# EAGLE schematic isolator (EAGLE 5.06)

## Sheet 1 of 5
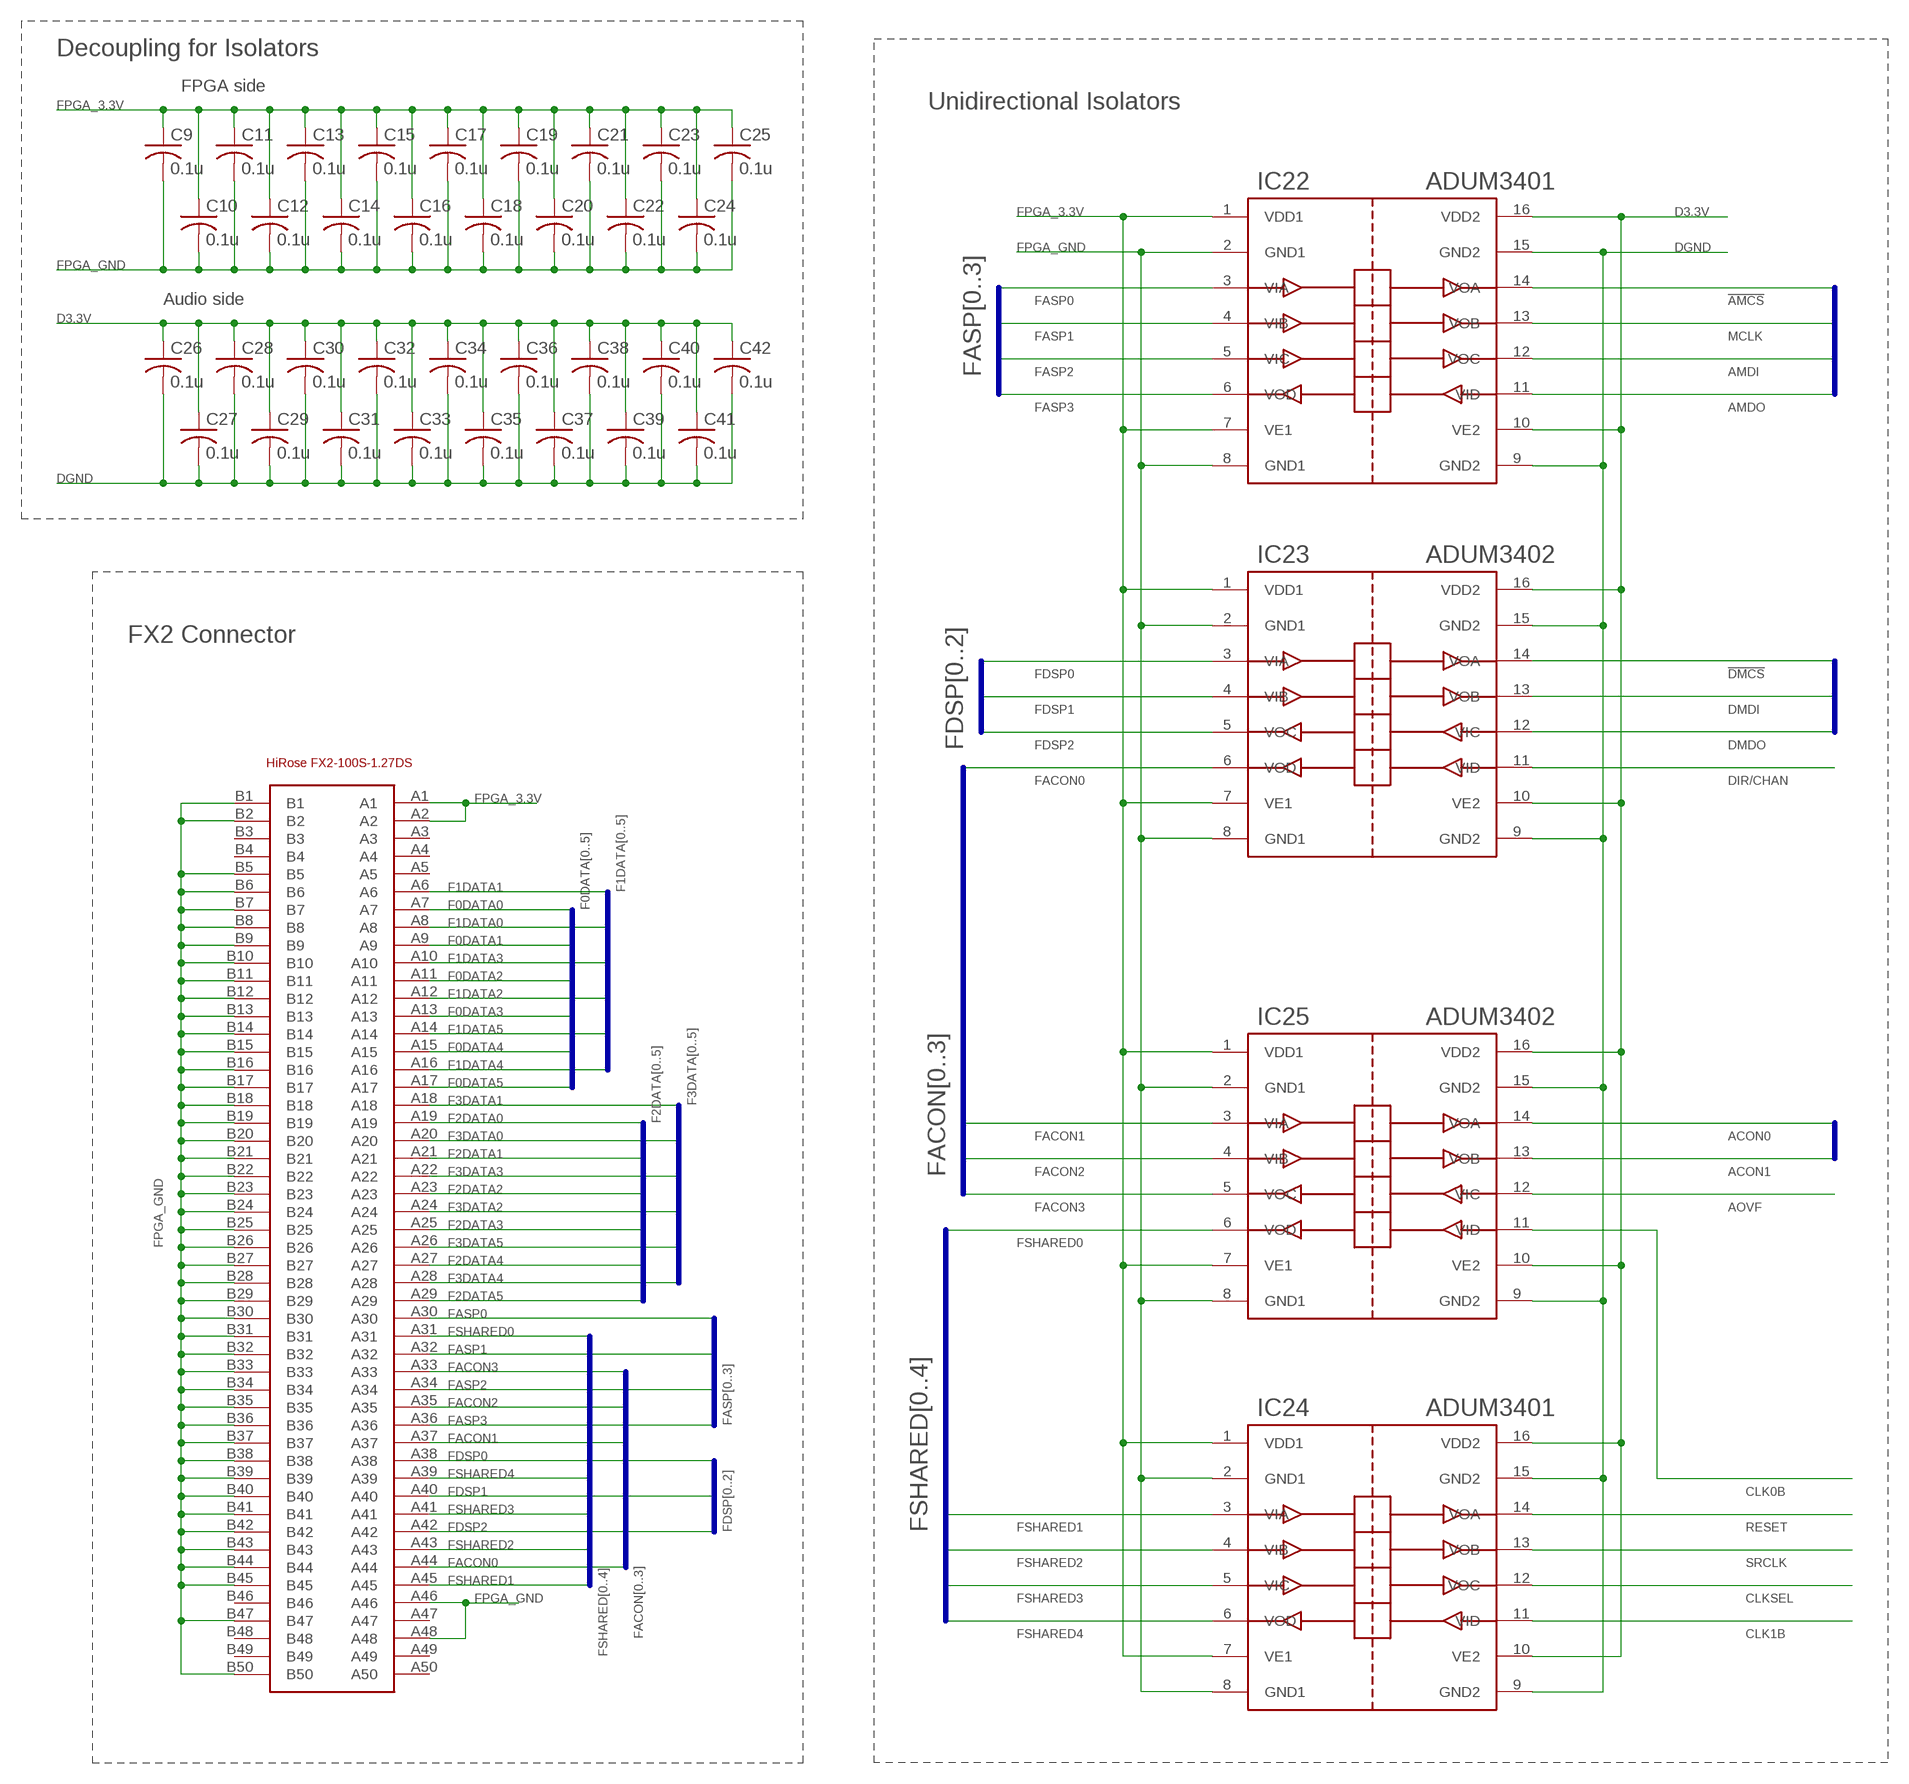
[diagram p0: schematic, sheet 1]

### Parts
C9  0.1u  C-USC1206  [C1206]
C10  0.1u  C-USC1206  [C1206]
C11  0.1u  C-USC1206  [C1206]
C12  0.1u  C-USC1206  [C1206]
C13  0.1u  C-USC1206  [C1206]
C14  0.1u  C-USC1206  [C1206]
C15  0.1u  C-USC1206  [C1206]
C16  0.1u  C-USC1206  [C1206]
C17  0.1u  C-USC1206  [C1206]
C18  0.1u  C-USC1206  [C1206]
C19  0.1u  C-USC1206  [C1206]
C20  0.1u  C-USC1206  [C1206]
C21  0.1u  C-USC1206  [C1206]
C22  0.1u  C-USC1206  [C1206]
C23  0.1u  C-USC1206  [C1206]
C24  0.1u  C-USC1206  [C1206]
C25  0.1u  C-USC1206  [C1206]
C26  0.1u  C-USC1206  [C1206]
C27  0.1u  C-USC1206  [C1206]
C28  0.1u  C-USC1206  [C1206]
C29  0.1u  C-USC1206  [C1206]
C30  0.1u  C-USC1206  [C1206]
C31  0.1u  C-USC1206  [C1206]
C32  0.1u  C-USC1206  [C1206]
C33  0.1u  C-USC1206  [C1206]
C34  0.1u  C-USC1206  [C1206]
C35  0.1u  C-USC1206  [C1206]
C36  0.1u  C-USC1206  [C1206]
C37  0.1u  C-USC1206  [C1206]
C38  0.1u  C-USC1206  [C1206]
C39  0.1u  C-USC1206  [C1206]
C40  0.1u  C-USC1206  [C1206]
C41  0.1u  C-USC1206  [C1206]
C42  0.1u  C-USC1206  [C1206]
IC22  ADUM3401  [SO-16W]
IC23  ADUM3402  [SO-16W]
IC24  ADUM3401  [SO-16W]
IC25  ADUM3402  [SO-16W]
J1  HIROSE-FX2-100S-1.27DS  [HIROSE-FX2-100]

### Nets
!AMCS: IC22.14(VOA) ; also sheet 5
!DMCS: IC23.14(VOA) ; also sheet 5
ACON0: IC25.14(VOA) ; also sheet 4
ACON1: IC25.13(VOB) ; also sheet 4
AMDI: IC22.12(VOC) ; also sheet 4
AMDO: IC22.11(VID) ; also sheet 4
AOVF: IC25.12(VIC) ; also sheet 5
CLK0B: IC25.11(VID) ; also sheet 5
CLK1B: IC24.11(VID) ; also sheet 5
CLKSEL: IC24.12(VOC) ; also sheet 5
D3.3V: C26.1 C27.1 C28.1 C29.1 C30.1 C31.1 C32.1 C33.1 C34.1 C35.1 C36.1 C37.1 C38.1 C39.1 C40.1 C41.1 C42.1 IC22.10(VE2) IC22.16(VDD2) IC23.10(VE2) IC23.16(VDD2) IC24.10(VE2) IC24.16(VDD2) IC25.10(VE2) IC25.16(VDD2) ; also sheet 2,3,4,5
DGND: C26.2 C27.2 C28.2 C29.2 C30.2 C31.2 C32.2 C33.2 C34.2 C35.2 C36.2 C37.2 C38.2 C39.2 C40.2 C41.2 C42.2 IC22.9(GND2) IC22.15(GND2) IC23.9(GND2) IC23.15(GND2) IC24.9(GND2) IC24.15(GND2) IC25.9(GND2) IC25.15(GND2) ; also sheet 2,3,4,5
DIR/CHAN: IC23.11(VID) ; also sheet 5
DMDI: IC23.13(VOB) ; also sheet 4
DMDO: IC23.12(VIC) ; also sheet 4
F0DATA0: J1.A7 ; also sheet 2
F0DATA1: J1.A9 ; also sheet 2
F0DATA2: J1.A11 ; also sheet 2
F0DATA3: J1.A13 ; also sheet 2
F0DATA4: J1.A15 ; also sheet 2
F0DATA5: J1.A17 ; also sheet 2
F1DATA0: J1.A8 ; also sheet 2
F1DATA1: J1.A6 ; also sheet 2
F1DATA2: J1.A12 ; also sheet 2
F1DATA3: J1.A10 ; also sheet 2
F1DATA4: J1.A16 ; also sheet 2
F1DATA5: J1.A14 ; also sheet 2
F2DATA0: J1.A19 ; also sheet 2
F2DATA1: J1.A21 ; also sheet 2
F2DATA2: J1.A23 ; also sheet 2
F2DATA3: J1.A25 ; also sheet 2
F2DATA4: J1.A27 ; also sheet 2
F2DATA5: J1.A29 ; also sheet 2
F3DATA0: J1.A20 ; also sheet 2
F3DATA1: J1.A18 ; also sheet 2
F3DATA2: J1.A24 ; also sheet 2
F3DATA3: J1.A22 ; also sheet 2
F3DATA4: J1.A28 ; also sheet 2
F3DATA5: J1.A26 ; also sheet 2
FACON0: IC23.6(VOD) J1.A44
FACON1: IC25.3(VIA) J1.A37
FACON2: IC25.4(VIB) J1.A35
FACON3: IC25.5(VOC) J1.A33
FASP0: IC22.3(VIA) J1.A30
FASP1: IC22.4(VIB) J1.A32
FASP2: IC22.5(VIC) J1.A34
FASP3: IC22.6(VOD) J1.A36
FDSP0: IC23.3(VIA) J1.A38
FDSP1: IC23.4(VIB) J1.A40
FDSP2: IC23.5(VOC) J1.A42
FPGA_3.3V: C9.1 C10.1 C11.1 C12.1 C13.1 C14.1 C15.1 C16.1 C17.1 C18.1 C19.1 C20.1 C21.1 C22.1 C23.1 C24.1 C25.1 IC22.1(VDD1) IC22.7(VE1) IC23.1(VDD1) IC23.7(VE1) IC24.1(VDD1) IC24.7(VE1) IC25.1(VDD1) IC25.7(VE1) J1.A1 J1.A2 ; also sheet 2
FPGA_GND: C9.2 C10.2 C11.2 C12.2 C13.2 C14.2 C15.2 C16.2 C17.2 C18.2 C19.2 C20.2 C21.2 C22.2 C23.2 C24.2 C25.2 IC22.2(GND1) IC22.8(GND1) IC23.2(GND1) IC23.8(GND1) IC24.2(GND1) IC24.8(GND1) IC25.2(GND1) IC25.8(GND1) J1.A46 J1.A48 J1.B1 J1.B2 J1.B5 J1.B6 J1.B7 J1.B8 J1.B9 J1.B10 J1.B11 J1.B12 J1.B13 J1.B14 J1.B15 J1.B16 J1.B17 J1.B18 J1.B19 J1.B20 J1.B21 J1.B22 J1.B23 J1.B24 J1.B25 J1.B26 J1.B27 J1.B28 J1.B29 J1.B30 J1.B31 J1.B32 J1.B33 J1.B34 J1.B35 J1.B36 J1.B37 J1.B38 J1.B39 J1.B40 J1.B41 J1.B42 J1.B43 J1.B44 J1.B45 J1.B47 J1.B50 ; also sheet 2
FSHARED0: IC25.6(VOD) J1.A31
FSHARED1: IC24.3(VIA) J1.A45
FSHARED2: IC24.4(VIB) J1.A43
FSHARED3: IC24.5(VIC) J1.A41
FSHARED4: IC24.6(VOD) J1.A39
MCLK: IC22.13(VOB) ; also sheet 4,5
RESET: IC24.14(VOA) ; also sheet 4
SRCLK: IC24.13(VOB) ; also sheet 4,5
Unconnected: J1.A3 J1.A4 J1.A5 J1.A47 J1.A49 J1.A50 J1.B3 J1.B4 J1.B46 J1.B48 J1.B49

### Buses
F1DATA[0..5]
F2DATA[0..5]
F3DATA[0..5]
F0DATA[0..5]
FASP[0..3]
FSHARED[0..4]
!AMCS,MCLK,AMDI,AMDO
!DMCS,MCLK,DMDI,DMDO
ACON[0..1]
FDSP[0..2]
FACON[0..3]

### Notes on the sheet
- Decoupling for Isolators
- FPGA side
- Unidirectional Isolators
- Audio side
- FX2 Connector

## Sheet 2 of 5
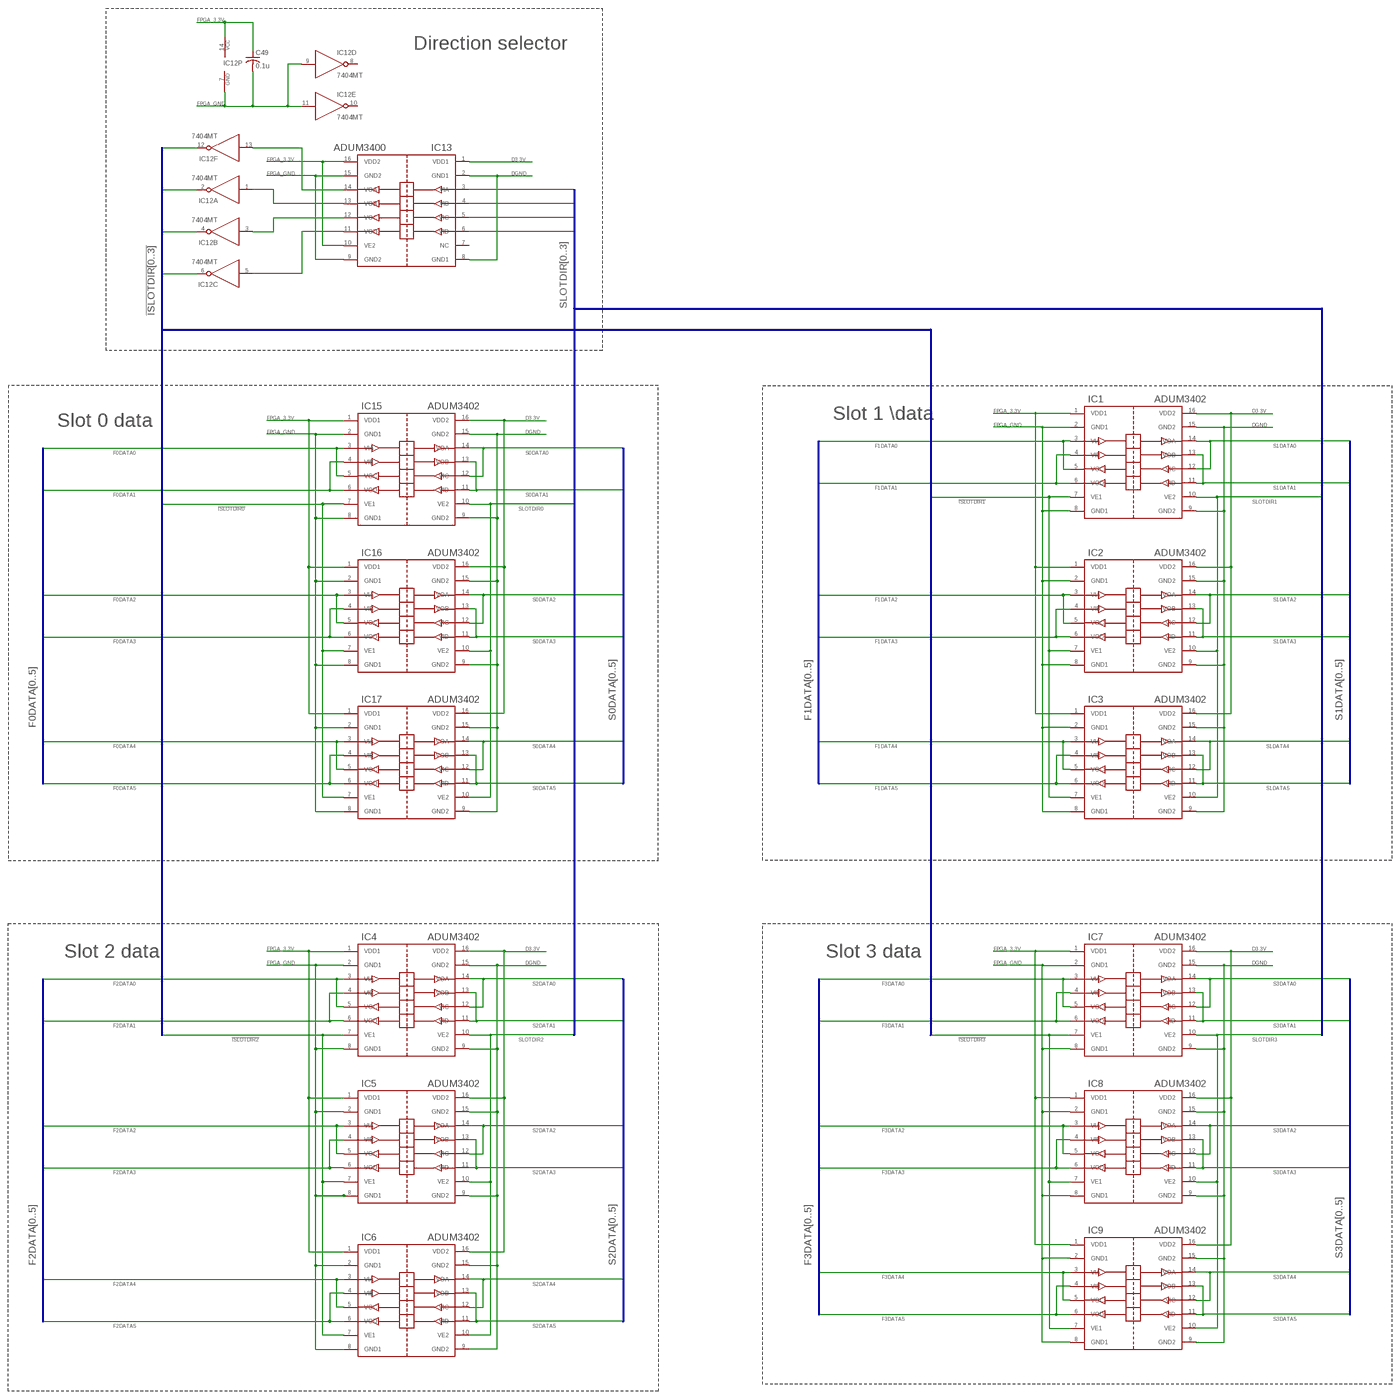
[diagram p1: schematic, sheet 2, overview]
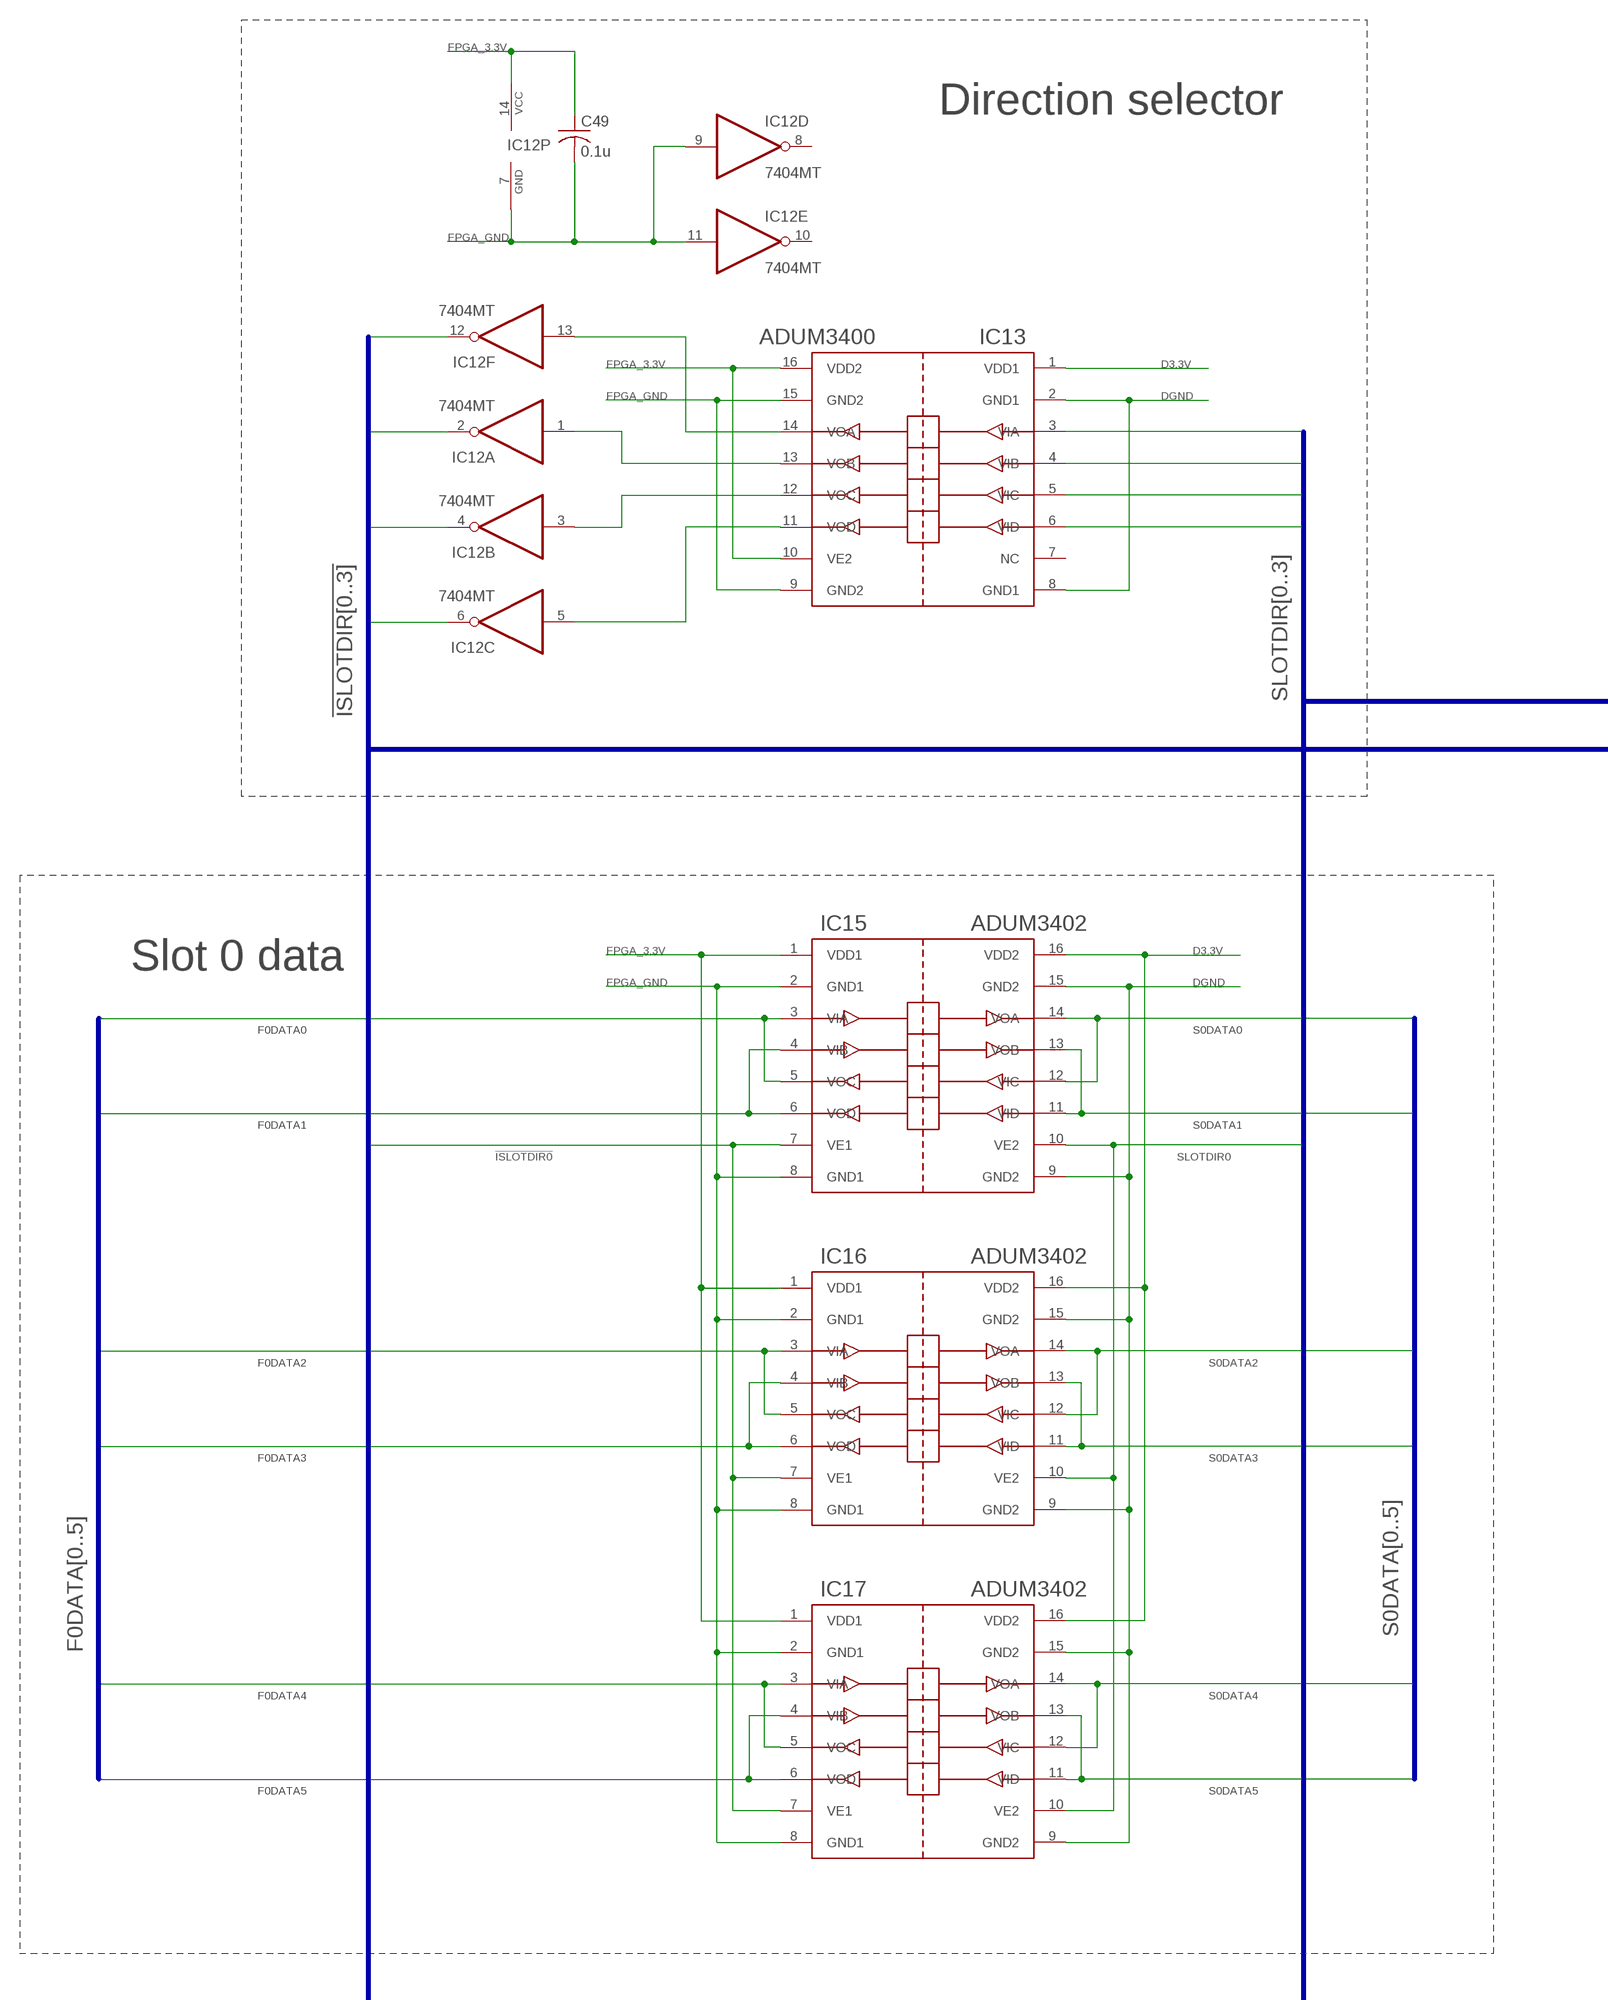
[diagram p2: schematic, sheet 2, part 1 of 4]
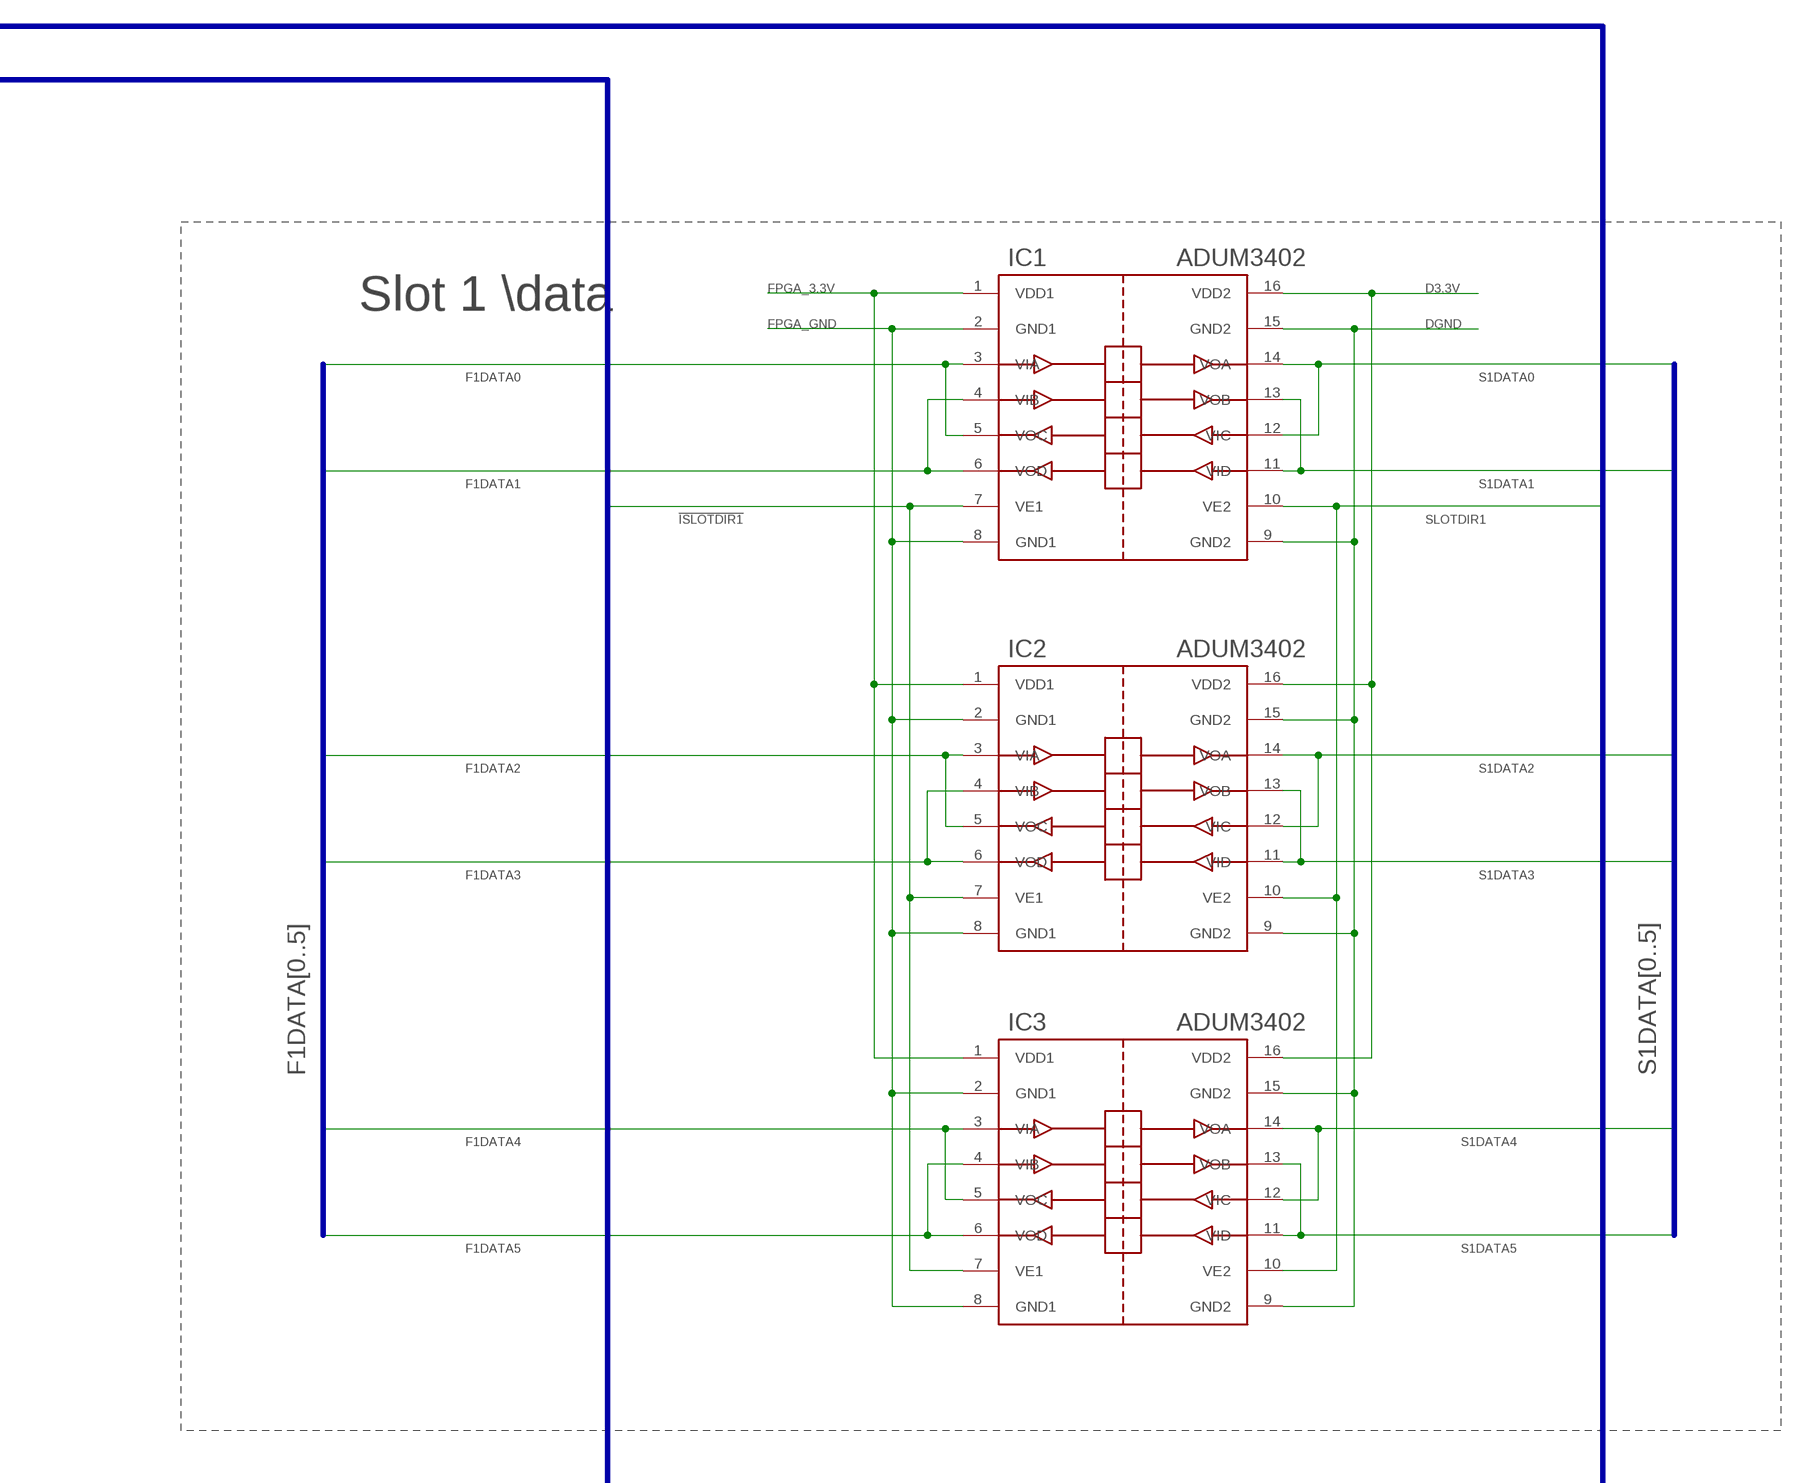
[diagram p3: schematic, sheet 2, part 2 of 4]
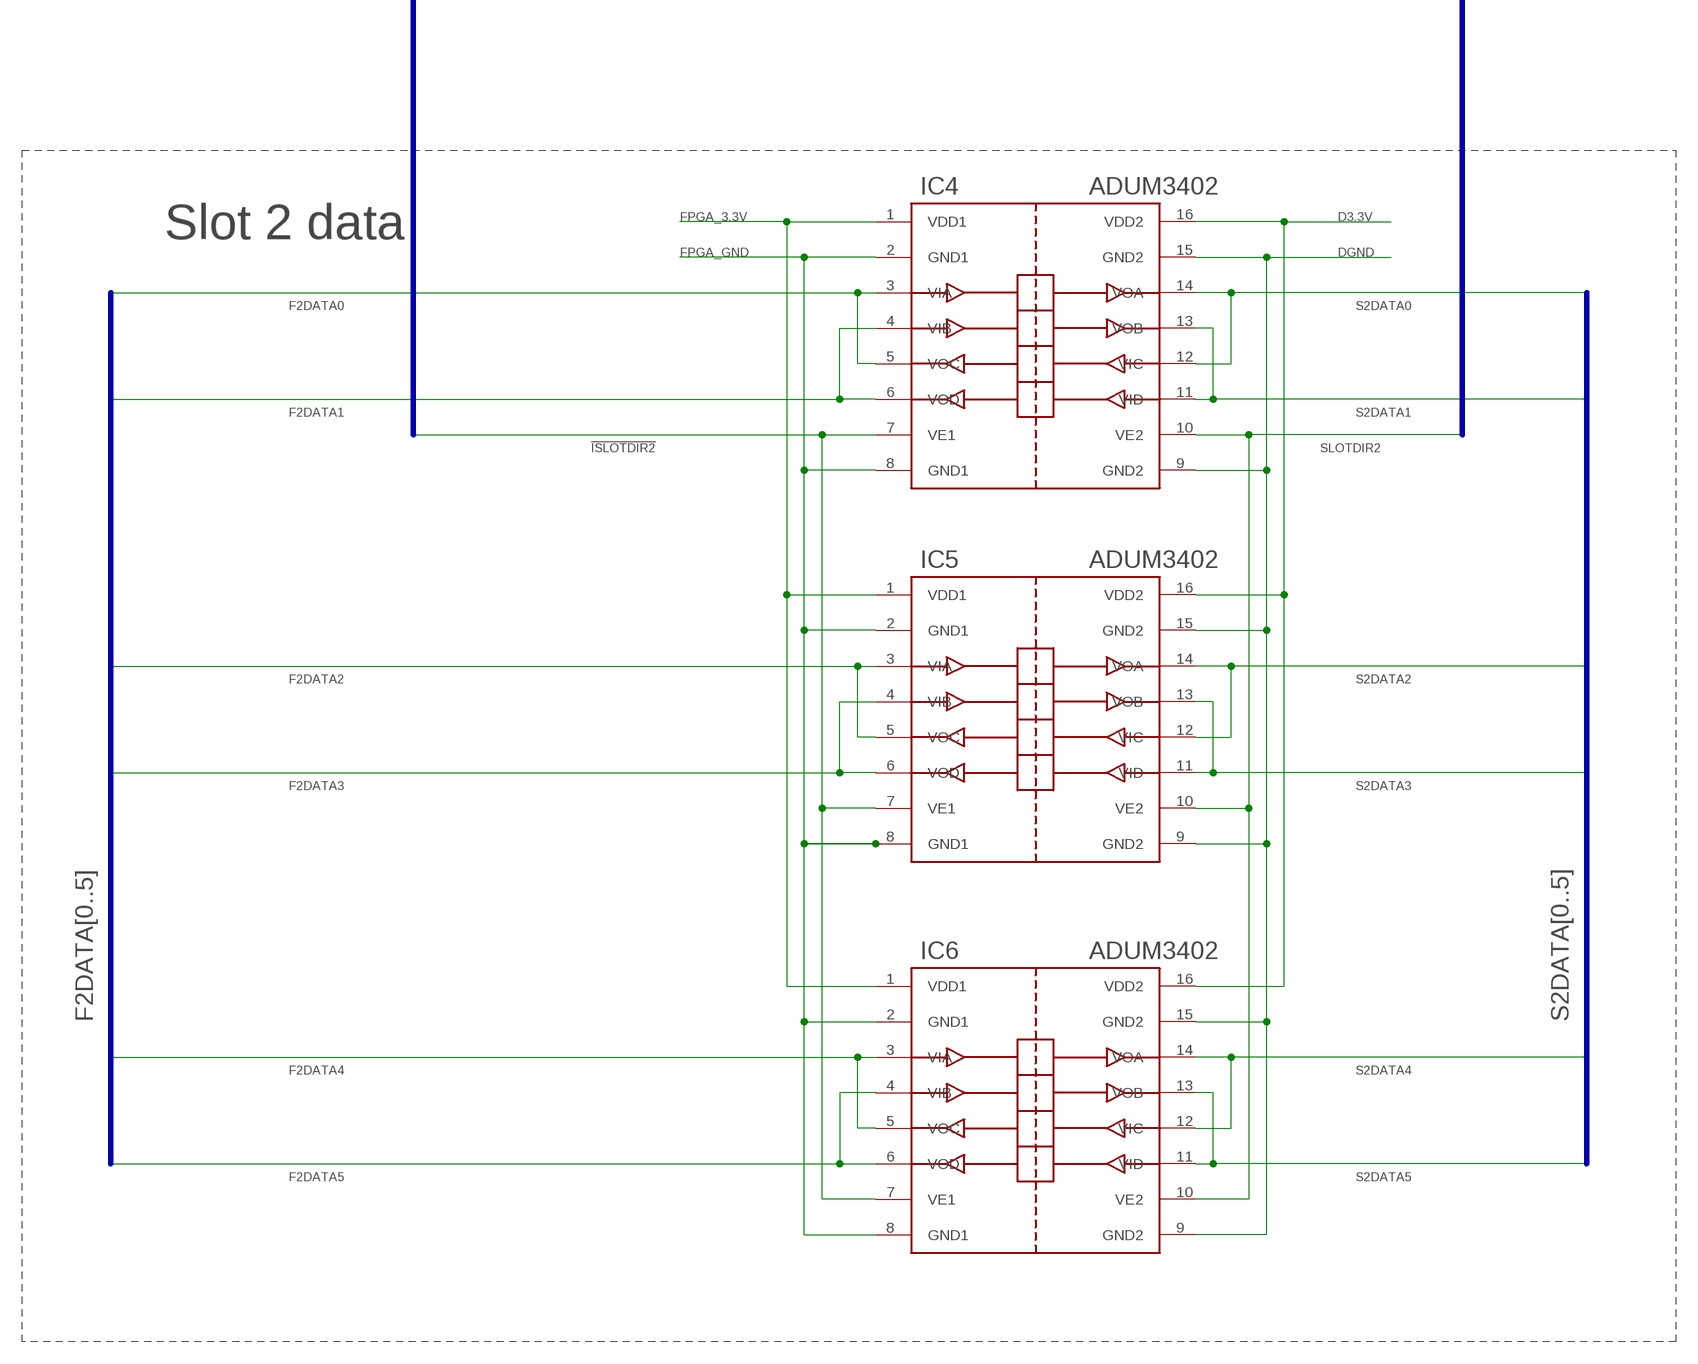
[diagram p4: schematic, sheet 2, part 3 of 4]
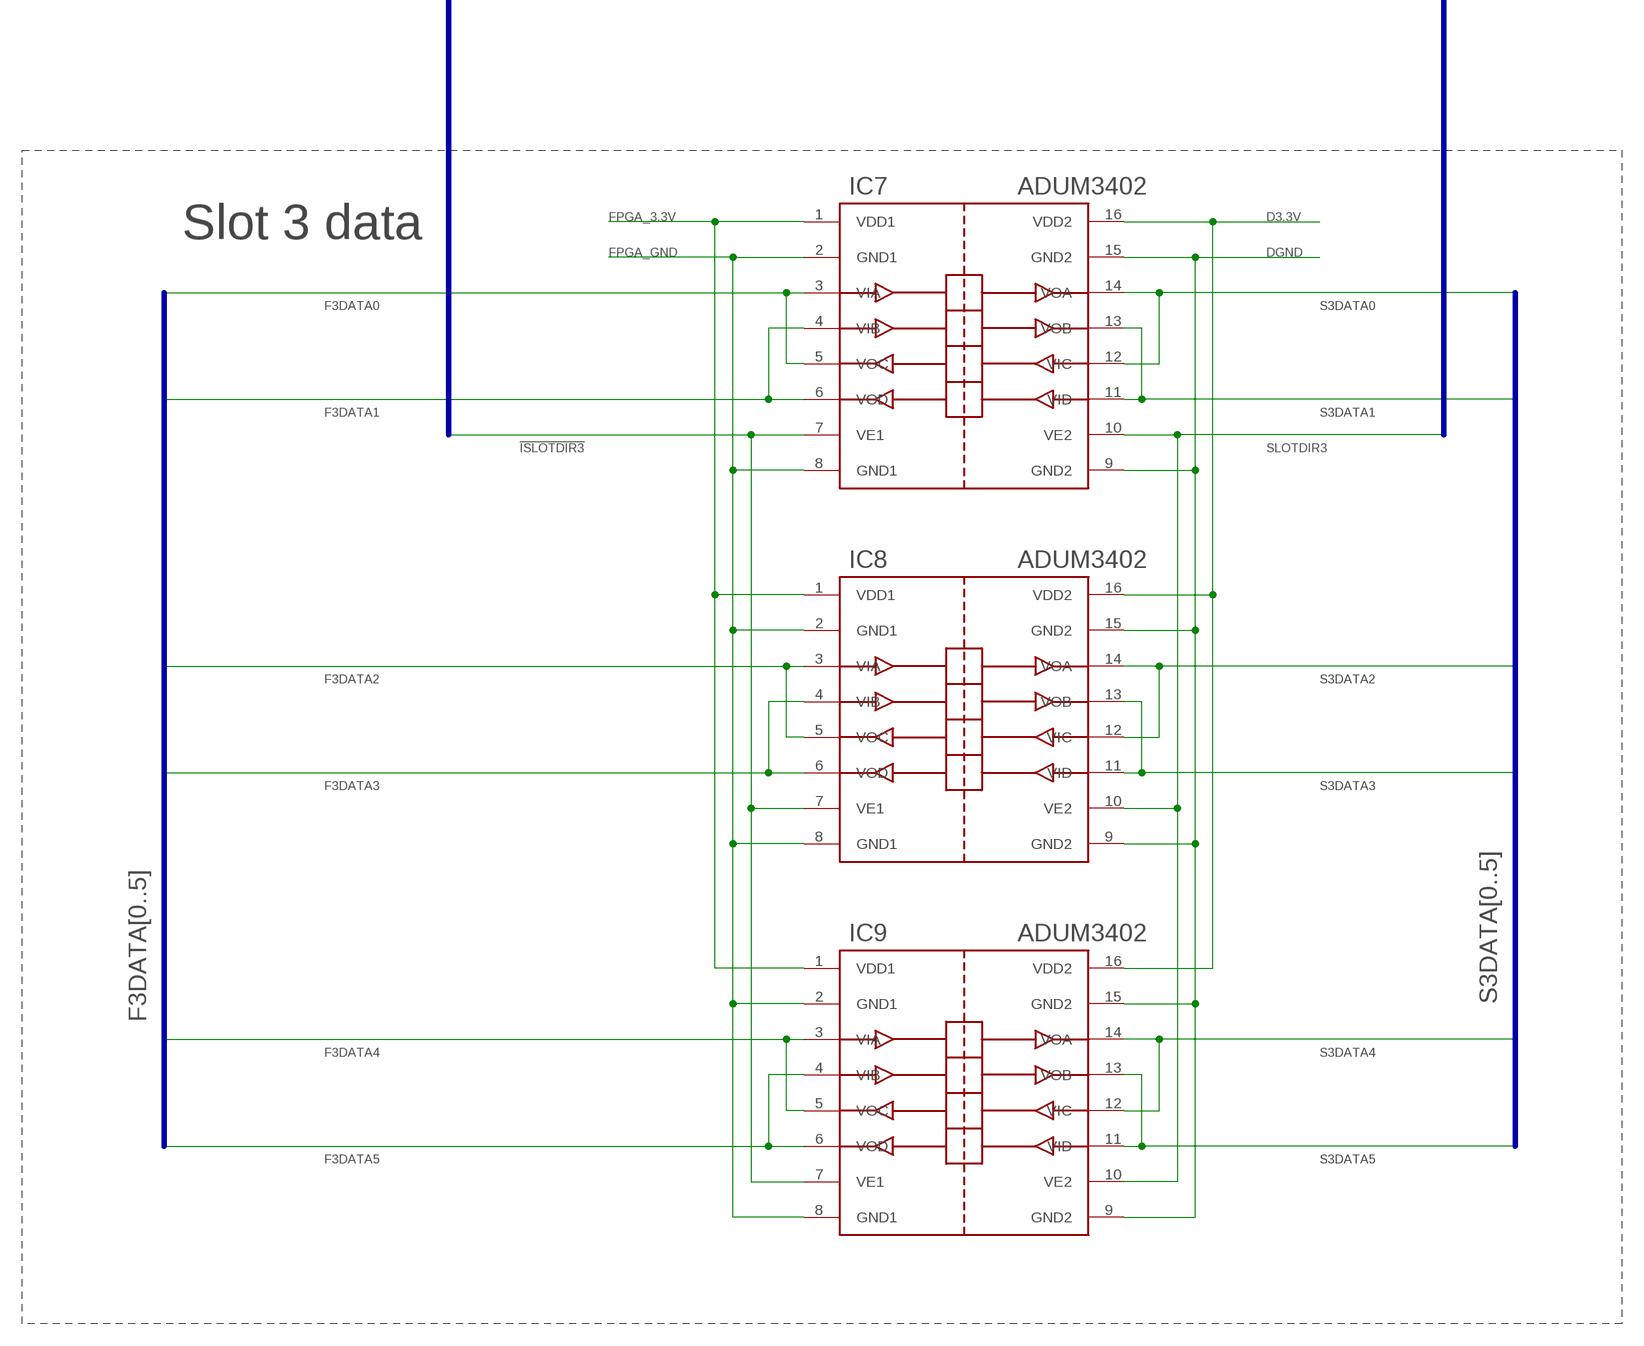
[diagram p5: schematic, sheet 2, part 4 of 4]

### Parts
C49  0.1u  C-USC1206  [C1206]
IC1  ADUM3402  [SO-16W]
IC2  ADUM3402  [SO-16W]
IC3  ADUM3402  [SO-16W]
IC4  ADUM3402  [SO-16W]
IC5  ADUM3402  [SO-16W]
IC6  ADUM3402  [SO-16W]
IC7  ADUM3402  [SO-16W]
IC8  ADUM3402  [SO-16W]
IC9  ADUM3402  [SO-16W]
IC12  7404MT  [TSSOP14]
IC13  ADUM3400  [SO-16W]
IC15  ADUM3402  [SO-16W]
IC16  ADUM3402  [SO-16W]
IC17  ADUM3402  [SO-16W]

### Nets
!ISLOTDIR0: IC12.6(C:O) IC15.7(VE1) IC16.7(VE1) IC17.7(VE1)
!ISLOTDIR1: IC1.7(VE1) IC2.7(VE1) IC3.7(VE1) IC12.4(B:O)
!ISLOTDIR2: IC4.7(VE1) IC5.7(VE1) IC6.7(VE1) IC12.2(A:O)
!ISLOTDIR3: IC7.7(VE1) IC8.7(VE1) IC9.7(VE1) IC12.12(F:O)
D3.3V: IC1.16(VDD2) IC2.16(VDD2) IC3.16(VDD2) IC4.16(VDD2) IC5.16(VDD2) IC6.16(VDD2) IC7.16(VDD2) IC8.16(VDD2) IC9.16(VDD2) IC13.1(VDD1) IC15.16(VDD2) IC16.16(VDD2) IC17.16(VDD2) ; also sheet 1,3,4,5
DGND: IC1.9(GND2) IC1.15(GND2) IC2.9(GND2) IC2.15(GND2) IC3.9(GND2) IC3.15(GND2) IC4.9(GND2) IC4.15(GND2) IC5.9(GND2) IC5.15(GND2) IC6.9(GND2) IC6.15(GND2) IC7.9(GND2) IC7.15(GND2) IC8.9(GND2) IC8.15(GND2) IC9.9(GND2) IC9.15(GND2) IC13.2(GND1) IC13.8(GND1) IC15.9(GND2) IC15.15(GND2) IC16.9(GND2) IC16.15(GND2) IC17.9(GND2) IC17.15(GND2) ; also sheet 1,3,4,5
F0DATA0: IC15.3(VIA) IC15.5(VOC) ; also sheet 1
F0DATA1: IC15.4(VIB) IC15.6(VOD) ; also sheet 1
F0DATA2: IC16.3(VIA) IC16.5(VOC) ; also sheet 1
F0DATA3: IC16.4(VIB) IC16.6(VOD) ; also sheet 1
F0DATA4: IC17.3(VIA) IC17.5(VOC) ; also sheet 1
F0DATA5: IC17.4(VIB) IC17.6(VOD) ; also sheet 1
F1DATA0: IC1.3(VIA) IC1.5(VOC) ; also sheet 1
F1DATA1: IC1.4(VIB) IC1.6(VOD) ; also sheet 1
F1DATA2: IC2.3(VIA) IC2.5(VOC) ; also sheet 1
F1DATA3: IC2.4(VIB) IC2.6(VOD) ; also sheet 1
F1DATA4: IC3.3(VIA) IC3.5(VOC) ; also sheet 1
F1DATA5: IC3.4(VIB) IC3.6(VOD) ; also sheet 1
F2DATA0: IC4.3(VIA) IC4.5(VOC) ; also sheet 1
F2DATA1: IC4.4(VIB) IC4.6(VOD) ; also sheet 1
F2DATA2: IC5.3(VIA) IC5.5(VOC) ; also sheet 1
F2DATA3: IC5.4(VIB) IC5.6(VOD) ; also sheet 1
F2DATA4: IC6.3(VIA) IC6.5(VOC) ; also sheet 1
F2DATA5: IC6.4(VIB) IC6.6(VOD) ; also sheet 1
F3DATA0: IC7.3(VIA) IC7.5(VOC) ; also sheet 1
F3DATA1: IC7.4(VIB) IC7.6(VOD) ; also sheet 1
F3DATA2: IC8.3(VIA) IC8.5(VOC) ; also sheet 1
F3DATA3: IC8.4(VIB) IC8.6(VOD) ; also sheet 1
F3DATA4: IC9.3(VIA) IC9.5(VOC) ; also sheet 1
F3DATA5: IC9.4(VIB) IC9.6(VOD) ; also sheet 1
FPGA_3.3V: C49.1 IC1.1(VDD1) IC2.1(VDD1) IC3.1(VDD1) IC4.1(VDD1) IC5.1(VDD1) IC6.1(VDD1) IC7.1(VDD1) IC8.1(VDD1) IC9.1(VDD1) IC12.14(P:VCC) IC13.10(VE2) IC13.16(VDD2) IC15.1(VDD1) IC16.1(VDD1) IC17.1(VDD1) ; also sheet 1
FPGA_GND: C49.2 IC1.2(GND1) IC1.8(GND1) IC2.2(GND1) IC2.8(GND1) IC3.2(GND1) IC3.8(GND1) IC4.2(GND1) IC4.8(GND1) IC5.2(GND1) IC5.8(GND1) IC6.2(GND1) IC6.8(GND1) IC7.2(GND1) IC7.8(GND1) IC8.2(GND1) IC8.8(GND1) IC9.2(GND1) IC9.8(GND1) IC12.7(P:GND) IC12.9(D:I) IC12.11(E:I) IC13.9(GND2) IC13.15(GND2) IC15.2(GND1) IC15.8(GND1) IC16.2(GND1) IC16.8(GND1) IC17.2(GND1) IC17.8(GND1) ; also sheet 1
ISLOTDIR0: IC12.5(C:I) IC13.11(VOD)
ISLOTDIR1: IC12.3(B:I) IC13.12(VOC)
ISLOTDIR2: IC12.1(A:I) IC13.13(VOB)
ISLOTDIR3: IC12.13(F:I) IC13.14(VOA)
S0DATA0: IC15.12(VIC) IC15.14(VOA) ; also sheet 4
S0DATA1: IC15.11(VID) IC15.13(VOB) ; also sheet 4
S0DATA2: IC16.12(VIC) IC16.14(VOA) ; also sheet 4
S0DATA3: IC16.11(VID) IC16.13(VOB) ; also sheet 4
S0DATA4: IC17.12(VIC) IC17.14(VOA) ; also sheet 4
S0DATA5: IC17.11(VID) IC17.13(VOB) ; also sheet 4
S1DATA0: IC1.12(VIC) IC1.14(VOA) ; also sheet 4
S1DATA1: IC1.11(VID) IC1.13(VOB) ; also sheet 4
S1DATA2: IC2.12(VIC) IC2.14(VOA) ; also sheet 4
S1DATA3: IC2.11(VID) IC2.13(VOB) ; also sheet 4
S1DATA4: IC3.12(VIC) IC3.14(VOA) ; also sheet 4
S1DATA5: IC3.11(VID) IC3.13(VOB) ; also sheet 4
S2DATA0: IC4.12(VIC) IC4.14(VOA) ; also sheet 4
S2DATA1: IC4.11(VID) IC4.13(VOB) ; also sheet 4
S2DATA2: IC5.12(VIC) IC5.14(VOA) ; also sheet 4
S2DATA3: IC5.11(VID) IC5.13(VOB) ; also sheet 4
S2DATA4: IC6.12(VIC) IC6.14(VOA) ; also sheet 4
S2DATA5: IC6.11(VID) IC6.13(VOB) ; also sheet 4
S3DATA0: IC7.12(VIC) IC7.14(VOA) ; also sheet 4
S3DATA1: IC7.11(VID) IC7.13(VOB) ; also sheet 4
S3DATA2: IC8.12(VIC) IC8.14(VOA) ; also sheet 4
S3DATA3: IC8.11(VID) IC8.13(VOB) ; also sheet 4
S3DATA4: IC9.12(VIC) IC9.14(VOA) ; also sheet 4
S3DATA5: IC9.11(VID) IC9.13(VOB) ; also sheet 4
SLOTDIR0: IC13.6(VID) IC15.10(VE2) IC16.10(VE2) IC17.10(VE2) ; also sheet 4,5
SLOTDIR1: IC1.10(VE2) IC2.10(VE2) IC3.10(VE2) IC13.5(VIC) ; also sheet 4,5
SLOTDIR2: IC4.10(VE2) IC5.10(VE2) IC6.10(VE2) IC13.4(VIB) ; also sheet 4,5
SLOTDIR3: IC7.10(VE2) IC8.10(VE2) IC9.10(VE2) IC13.3(VIA) ; also sheet 4,5
Unconnected: IC12.8(D:O) IC12.10(E:O) IC13.7(NC)

### Buses
F0DATA[0..5]
S0DATA[0..5]
F1DATA[0..5]
S1DATA[0..5]
F2DATA[0..5]
S2DATA[0..5]
SLOTDIR[0..3]
!ISLOTDIR[0..3]
S3DATA[0..5]
F3DATA[0..5]

### Notes on the sheet
- Direction selector
- Slot 1 \data
- Slot 0 data
- Slot 2 data | Slot 3 data

## Sheet 3 of 5
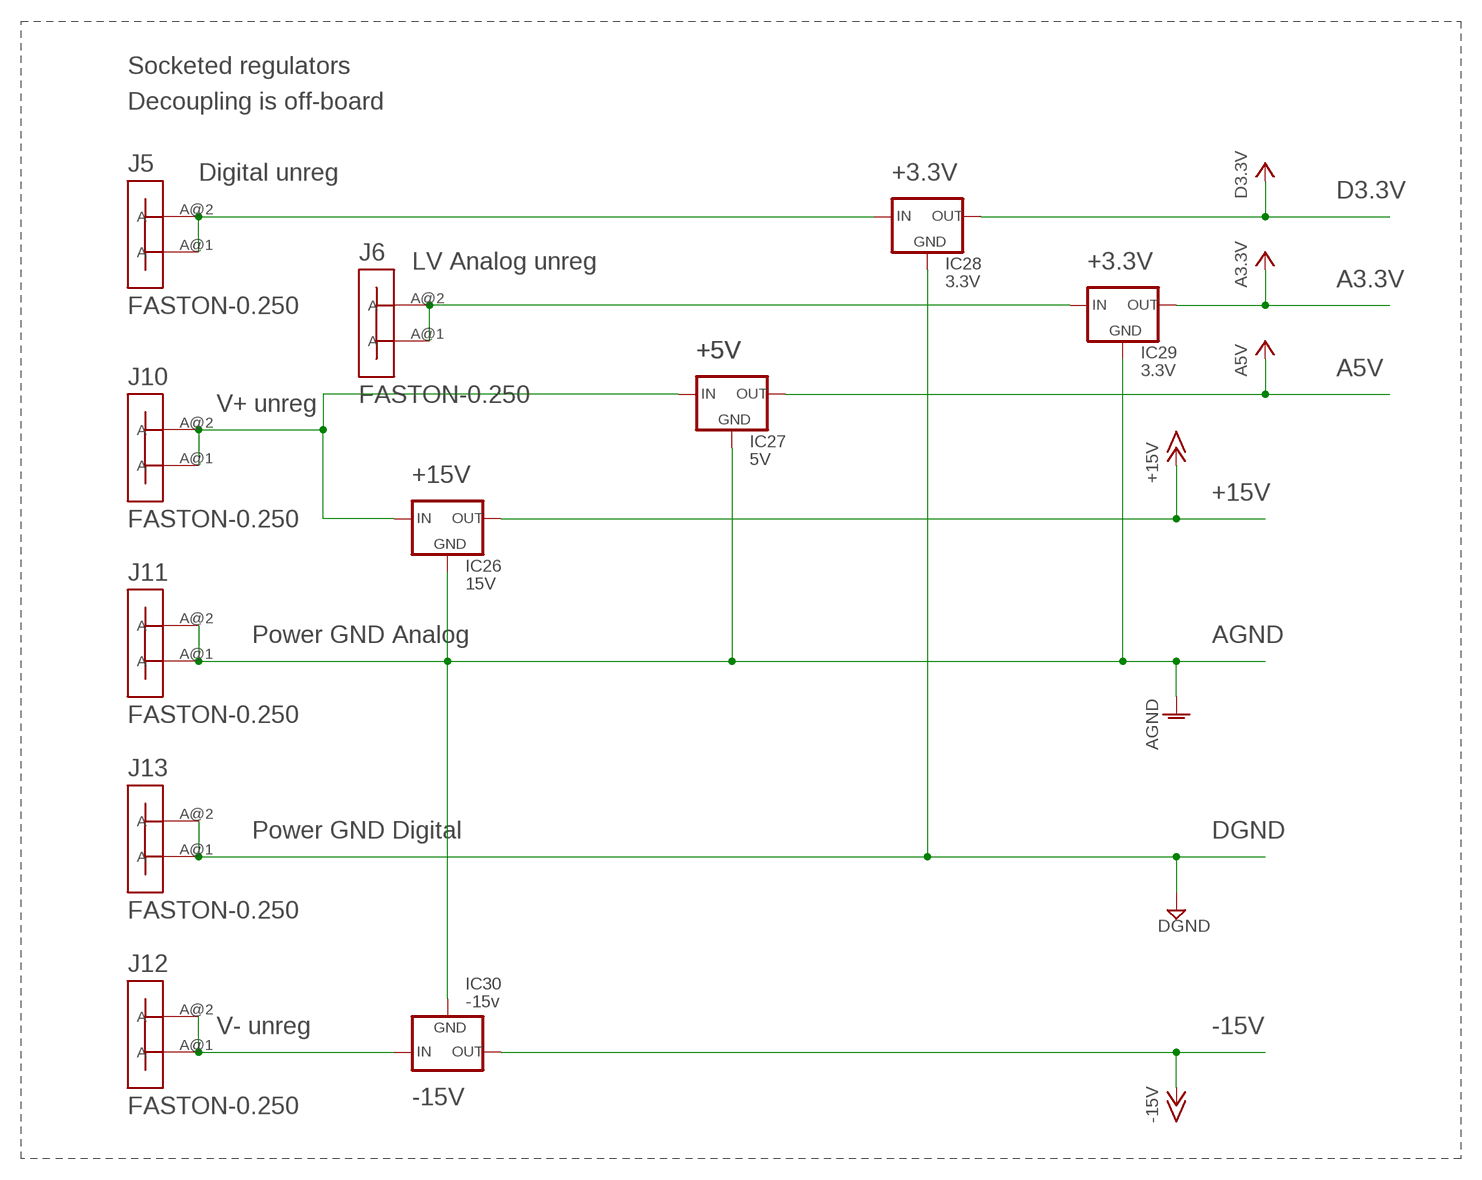
[diagram p6: schematic, sheet 3]

### Parts
IC26  15V  78XXL  [TO220-PREG]
IC27  5V  78XXL  [TO220-PREG]
IC28  3.3V  78XXL  [TO220-PREG]
IC29  3.3V  78XXL  [TO220-PREG]
IC30  -15v  79XXL  [TO220-NREG]
J5  FASTON-0.250  [FASTON-0.250]
J6  FASTON-0.250  [FASTON-0.250]
J10  FASTON-0.250  [FASTON-0.250]
J11  FASTON-0.250  [FASTON-0.250]
J12  FASTON-0.250  [FASTON-0.250]
J13  FASTON-0.250  [FASTON-0.250]

### Nets
+15V: IC26.3(OUT) ; also sheet 4,5
-15V: IC30.3(OUT) ; also sheet 4,5
A3.3V: IC29.3(OUT) ; also sheet 4
A5V: IC27.3(OUT) ; also sheet 4,5
AGND: IC26.2(GND) IC27.2(GND) IC29.2(GND) IC30.1(GND) J11.A@1(A) J11.A@2(A) ; also sheet 4,5
D3.3V: IC28.3(OUT) ; also sheet 1,2,4,5
DGND: IC28.2(GND) J13.A@1(A) J13.A@2(A) ; also sheet 1,2,4,5
N$1: IC30.2(IN) J12.A@1(A) J12.A@2(A)
N$2: IC26.1(IN) IC27.1(IN) J10.A@1(A) J10.A@2(A)
N$32: IC28.1(IN) J5.A@1(A) J5.A@2(A)
N$35: IC29.1(IN) J6.A@1(A) J6.A@2(A)

### Notes on the sheet
- Socketed regulators
- Decoupling is off-board
- Digital unreg | +3.3V
- LV Analog unreg | +3.3V
- +5V | +5V
- V+ unreg
- +15V
- Power GND Analog
- Power GND Digital
- V- unreg
- -15V

## Sheet 4 of 5
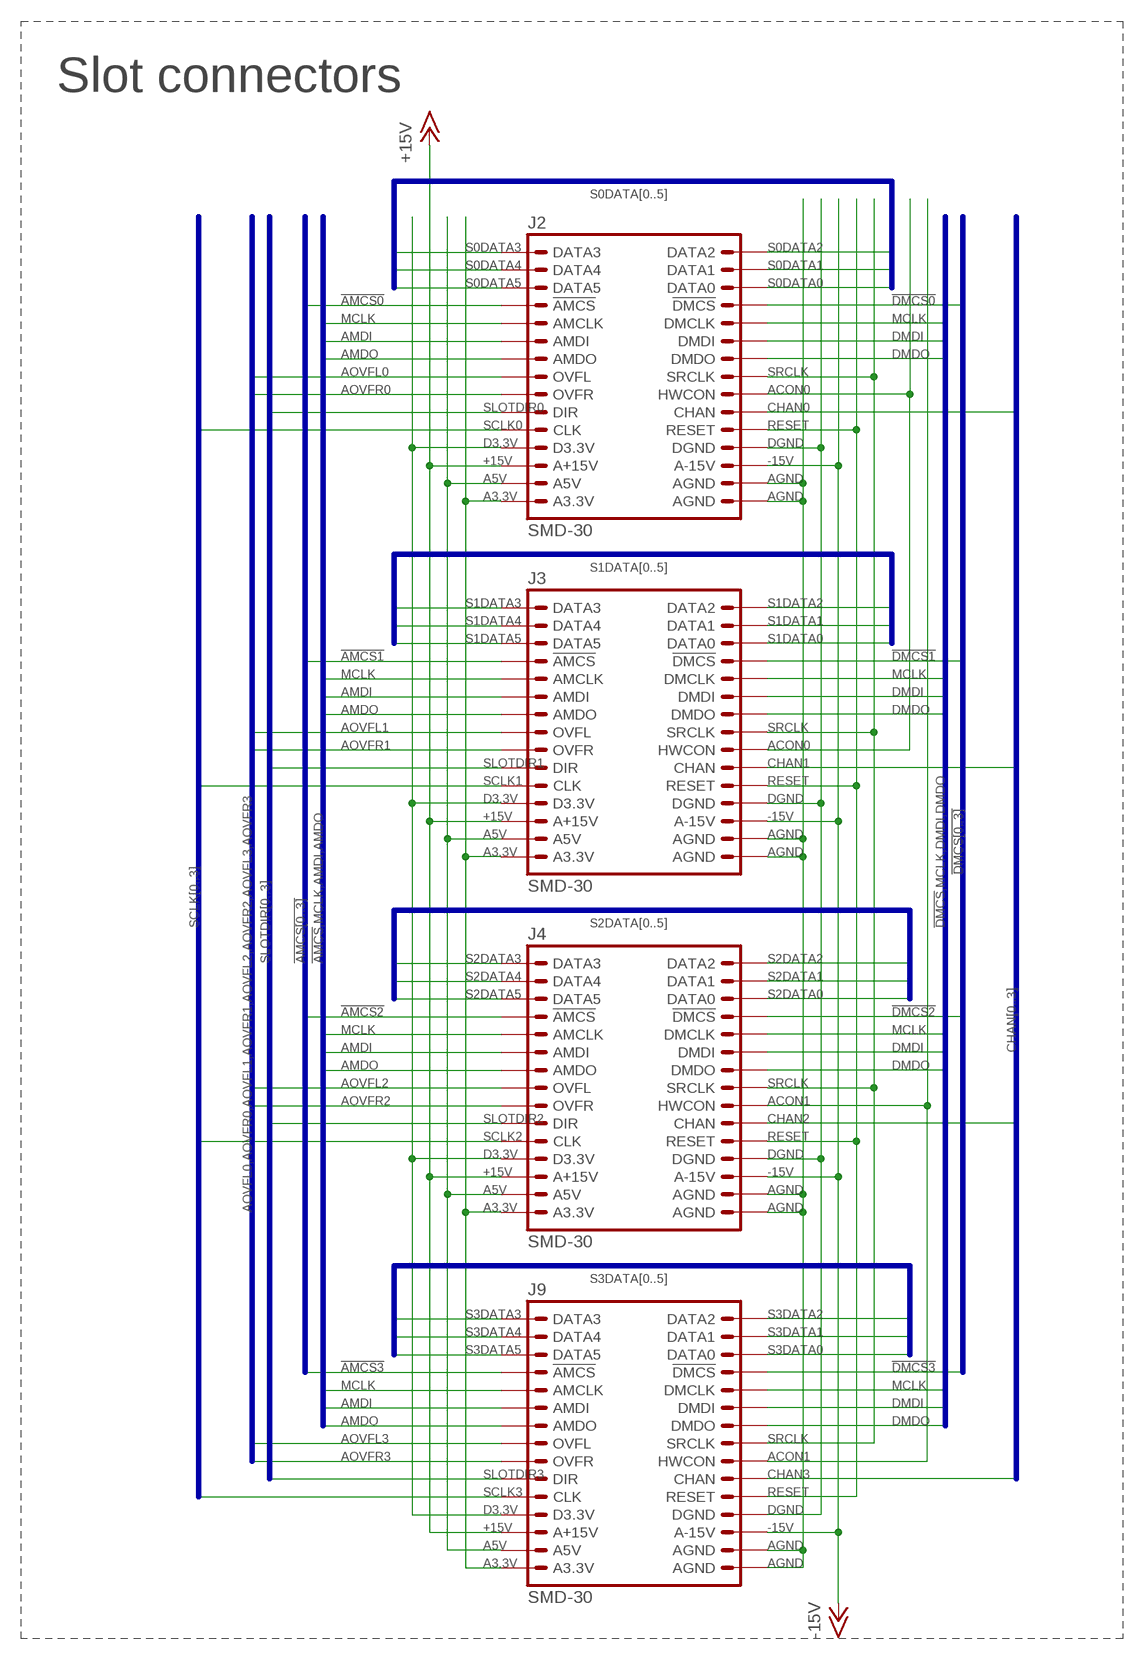
[diagram p7: schematic, sheet 4]

### Parts
J2  SMD-30  [FCI-SMD-30]
J3  SMD-30  [FCI-SMD-30]
J4  SMD-30  [FCI-SMD-30]
J9  SMD-30  [FCI-SMD-30]

### Nets
!AMCS0: J2.19(!AMCS) ; also sheet 5
!AMCS1: J3.19(!AMCS) ; also sheet 5
!AMCS2: J4.19(!AMCS) ; also sheet 5
!AMCS3: J9.19(!AMCS) ; also sheet 5
!DMCS0: J2.12(!DMCS) ; also sheet 5
!DMCS1: J3.12(!DMCS) ; also sheet 5
!DMCS2: J4.12(!DMCS) ; also sheet 5
!DMCS3: J9.12(!DMCS) ; also sheet 5
+15V: J2.28(A+15V) J3.28(A+15V) J4.28(A+15V) J9.28(A+15V) ; also sheet 3,5
-15V: J2.3(A-15V) J3.3(A-15V) J4.3(A-15V) J9.3(A-15V) ; also sheet 3,5
A3.3V: J2.30(A3.3V) J3.30(A3.3V) J4.30(A3.3V) J9.30(A3.3V) ; also sheet 3
A5V: J2.29(A5V) J3.29(A5V) J4.29(A5V) J9.29(A5V) ; also sheet 3,5
ACON0: J2.7(HWCON) J3.7(HWCON) ; also sheet 1
ACON1: J4.7(HWCON) J9.7(HWCON) ; also sheet 1
AGND: J2.1(AGND) J2.2(AGND) J3.1(AGND) J3.2(AGND) J4.1(AGND) J4.2(AGND) J9.1(AGND) J9.2(AGND) ; also sheet 3,5
AMDI: J2.21(AMDI) J3.21(AMDI) J4.21(AMDI) J9.21(AMDI) ; also sheet 1
AMDO: J2.22(AMDO) J3.22(AMDO) J4.22(AMDO) J9.22(AMDO) ; also sheet 1
AOVFL0: J2.23(OVFL) ; also sheet 5
AOVFL1: J3.23(OVFL) ; also sheet 5
AOVFL2: J4.23(OVFL) ; also sheet 5
AOVFL3: J9.23(OVFL) ; also sheet 5
AOVFR0: J2.24(OVFR) ; also sheet 5
AOVFR1: J3.24(OVFR) ; also sheet 5
AOVFR2: J4.24(OVFR) ; also sheet 5
AOVFR3: J9.24(OVFR) ; also sheet 5
CHAN0: J2.6(CHAN) ; also sheet 5
CHAN1: J3.6(CHAN) ; also sheet 5
CHAN2: J4.6(CHAN) ; also sheet 5
CHAN3: J9.6(CHAN) ; also sheet 5
D3.3V: J2.27(D3.3V) J3.27(D3.3V) J4.27(D3.3V) J9.27(D3.3V) ; also sheet 1,2,3,5
DGND: J2.4(DGND) J3.4(DGND) J4.4(DGND) J9.4(DGND) ; also sheet 1,2,3,5
DMDI: J2.10(DMDI) J3.10(DMDI) J4.10(DMDI) J9.10(DMDI) ; also sheet 1
DMDO: J2.9(DMDO) J3.9(DMDO) J4.9(DMDO) J9.9(DMDO) ; also sheet 1
MCLK: J2.11(DMCLK) J2.20(AMCLK) J3.11(DMCLK) J3.20(AMCLK) J4.11(DMCLK) J4.20(AMCLK) J9.11(DMCLK) J9.20(AMCLK) ; also sheet 1,5
RESET: J2.5(RESET) J3.5(RESET) J4.5(RESET) J9.5(RESET) ; also sheet 1
S0DATA0: J2.13(DATA0) ; also sheet 2
S0DATA1: J2.14(DATA1) ; also sheet 2
S0DATA2: J2.15(DATA2) ; also sheet 2
S0DATA3: J2.16(DATA3) ; also sheet 2
S0DATA4: J2.17(DATA4) ; also sheet 2
S0DATA5: J2.18(DATA5) ; also sheet 2
S1DATA0: J3.13(DATA0) ; also sheet 2
S1DATA1: J3.14(DATA1) ; also sheet 2
S1DATA2: J3.15(DATA2) ; also sheet 2
S1DATA3: J3.16(DATA3) ; also sheet 2
S1DATA4: J3.17(DATA4) ; also sheet 2
S1DATA5: J3.18(DATA5) ; also sheet 2
S2DATA0: J4.13(DATA0) ; also sheet 2
S2DATA1: J4.14(DATA1) ; also sheet 2
S2DATA2: J4.15(DATA2) ; also sheet 2
S2DATA3: J4.16(DATA3) ; also sheet 2
S2DATA4: J4.17(DATA4) ; also sheet 2
S2DATA5: J4.18(DATA5) ; also sheet 2
S3DATA0: J9.13(DATA0) ; also sheet 2
S3DATA1: J9.14(DATA1) ; also sheet 2
S3DATA2: J9.15(DATA2) ; also sheet 2
S3DATA3: J9.16(DATA3) ; also sheet 2
S3DATA4: J9.17(DATA4) ; also sheet 2
S3DATA5: J9.18(DATA5) ; also sheet 2
SCLK0: J2.26(CLK) ; also sheet 5
SCLK1: J3.26(CLK) ; also sheet 5
SCLK2: J4.26(CLK) ; also sheet 5
SCLK3: J9.26(CLK) ; also sheet 5
SLOTDIR0: J2.25(DIR) ; also sheet 2,5
SLOTDIR1: J3.25(DIR) ; also sheet 2,5
SLOTDIR2: J4.25(DIR) ; also sheet 2,5
SLOTDIR3: J9.25(DIR) ; also sheet 2,5
SRCLK: J2.8(SRCLK) J3.8(SRCLK) J4.8(SRCLK) J9.8(SRCLK) ; also sheet 1,5

### Buses
!AMCS,MCLK,AMDI,AMDO
!DMCS,MCLK,DMDI,DMDO
!AMCS[0..3]
!DMCS[0..3]
AOVFL0,AOVFR0,AOVFL1,AOVFR1,AOVFL2,AOVFR2,AOVFL3,AOVFR3
SLOTDIR[0..3]
SCLK[0..3]
CHAN[0..3]
S3DATA[0..5]
S2DATA[0..5]
S1DATA[0..5]
S0DATA[0..5]

### Notes on the sheet
- Slot connectors

## Sheet 5 of 5
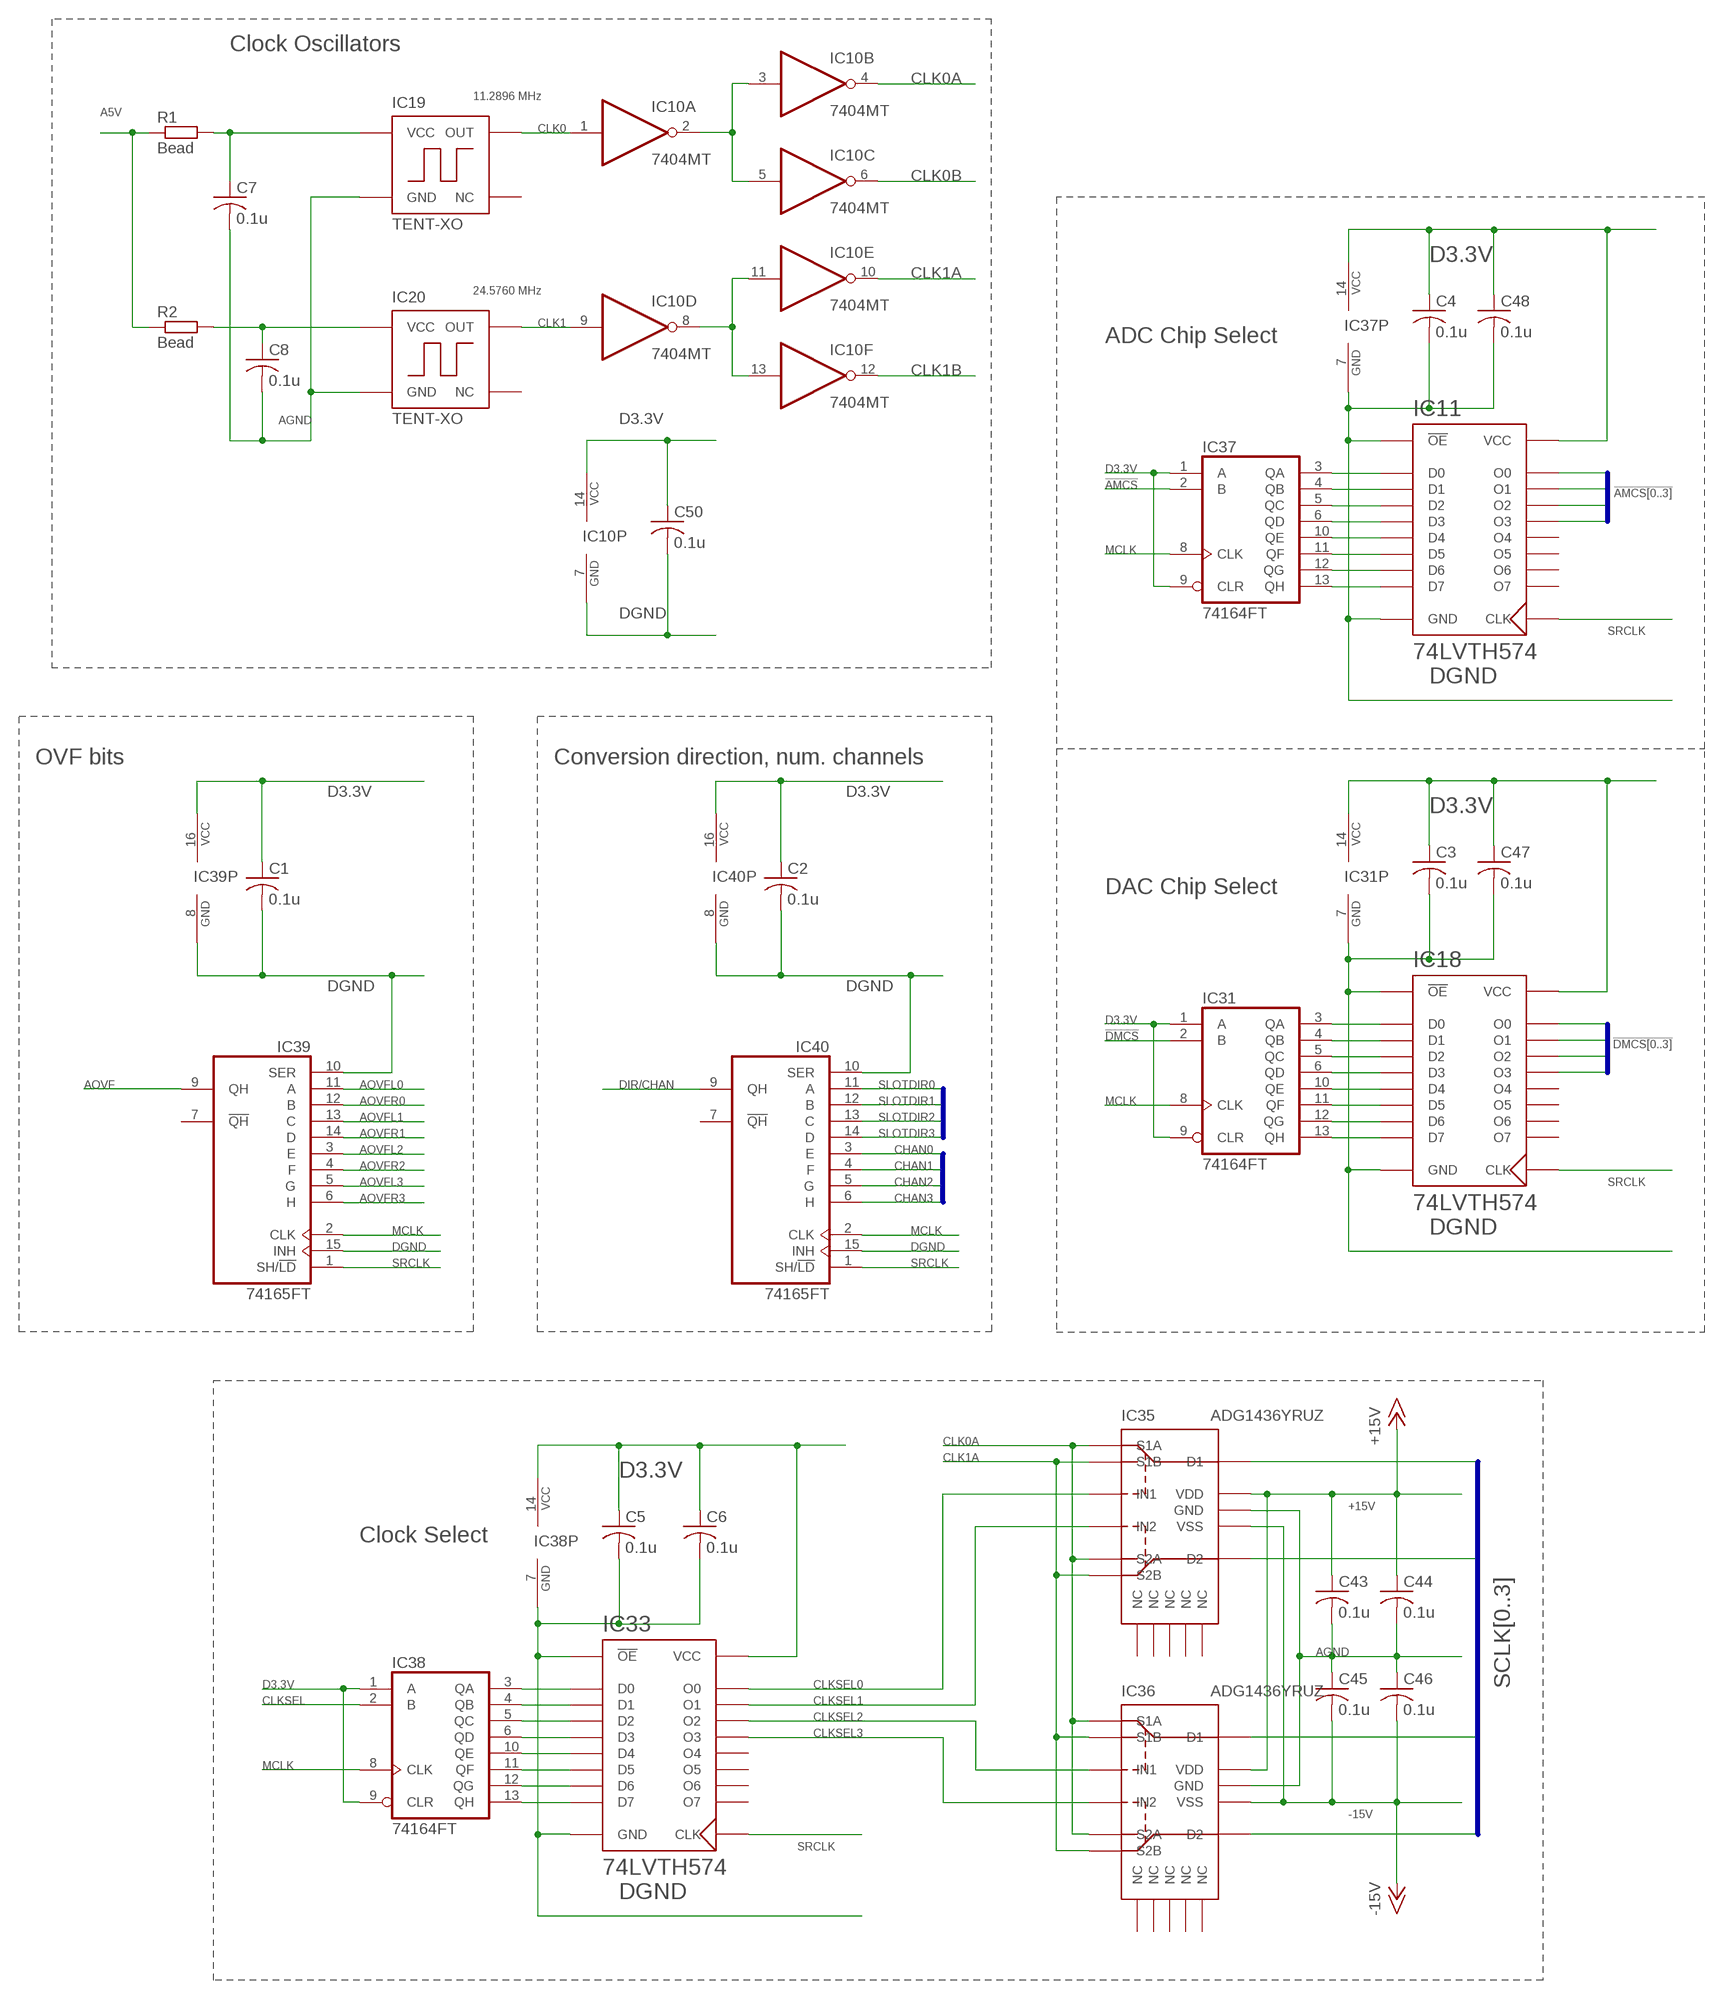
[diagram p8: schematic, sheet 5]

### Parts
C1  0.1u  C-USC1206  [C1206]
C2  0.1u  C-USC1206  [C1206]
C3  0.1u  C-USC1206  [C1206]
C4  0.1u  C-USC1206  [C1206]
C5  0.1u  C-USC1206  [C1206]
C6  0.1u  C-USC1206  [C1206]
C7  0.1u  C-USC1206  [C1206]
C8  0.1u  C-USC1206  [C1206]
C43  0.1u  C-USC1206  [C1206]
C44  0.1u  C-USC1206  [C1206]
C45  0.1u  C-USC1206  [C1206]
C46  0.1u  C-USC1206  [C1206]
C47  0.1u  C-USC1206  [C1206]
C48  0.1u  C-USC1206  [C1206]
C50  0.1u  C-USC1206  [C1206]
IC10  7404MT  [TSSOP14]
IC11  74LVTH574  [TSSOP20]
IC18  74LVTH574  [TSSOP20]
IC19  TENT-XO  [DIP4-XO]
IC20  TENT-XO  [DIP4-XO]
IC31  74164FT  [TSSOP14]
IC33  74LVTH574  [TSSOP20]
IC35  ADG1436YRUZ  [TSSOP16]
IC36  ADG1436YRUZ  [TSSOP16]
IC37  74164FT  [TSSOP14]
IC38  74164FT  [TSSOP14]
IC39  74165FT  [TSSOP16]
IC40  74165FT  [TSSOP16]
R1  Bead  R-EU_R1206  [R1206]
R2  Bead  R-EU_R1206  [R1206]

### Nets
!AMCS: IC37.2(B) ; also sheet 1
!AMCS0: IC11.19(O0) ; also sheet 4
!AMCS1: IC11.18(O1) ; also sheet 4
!AMCS2: IC11.17(O2) ; also sheet 4
!AMCS3: IC11.16(O3) ; also sheet 4
!DMCS: IC31.2(B) ; also sheet 1
!DMCS0: IC18.19(O0) ; also sheet 4
!DMCS1: IC18.18(O1) ; also sheet 4
!DMCS2: IC18.17(O2) ; also sheet 4
!DMCS3: IC18.16(O3) ; also sheet 4
+15V: C43.1 C44.1 IC35.13(VDD) IC36.13(VDD) ; also sheet 3,4
-15V: C45.2 C46.2 IC35.5(VSS) IC36.5(VSS) ; also sheet 3,4
A5V: R1.1 R2.1 ; also sheet 3,4
AGND: C7.2 C8.2 C43.2 C44.2 C45.1 C46.1 IC19.4(GND) IC20.4(GND) IC35.6(GND) IC36.6(GND) ; also sheet 3,4
AOVF: IC39.9(QH) ; also sheet 1
AOVFL0: IC39.11(A) ; also sheet 4
AOVFL1: IC39.13(C) ; also sheet 4
AOVFL2: IC39.3(E) ; also sheet 4
AOVFL3: IC39.5(G) ; also sheet 4
AOVFR0: IC39.12(B) ; also sheet 4
AOVFR1: IC39.14(D) ; also sheet 4
AOVFR2: IC39.4(F) ; also sheet 4
AOVFR3: IC39.6(H) ; also sheet 4
CHAN0: IC40.3(E) ; also sheet 4
CHAN1: IC40.4(F) ; also sheet 4
CHAN2: IC40.5(G) ; also sheet 4
CHAN3: IC40.6(H) ; also sheet 4
CLK0: IC10.1(A:I) IC19.5(OUT)
CLK0A: IC10.4(B:O) IC35.2(S1A) IC35.10(S2A) IC36.2(S1A) IC36.10(S2A)
CLK0B: IC10.6(C:O) ; also sheet 1
CLK1: IC10.9(D:I) IC20.5(OUT)
CLK1A: IC10.10(E:O) IC35.4(S1B) IC35.12(S2B) IC36.4(S1B) IC36.12(S2B)
CLK1B: IC10.12(F:O) ; also sheet 1
CLKSEL: IC38.2(B) ; also sheet 1
CLKSEL0: IC33.19(O0) IC35.1(IN1)
CLKSEL1: IC33.18(O1) IC35.9(IN2)
CLKSEL2: IC33.17(O2) IC36.1(IN1)
CLKSEL3: IC33.16(O3) IC36.9(IN2)
D3.3V: C1.1 C2.1 C3.1 C4.1 C5.1 C6.1 C47.1 C48.1 C50.1 IC10.14(P:VCC) IC11.20(VCC) IC18.20(VCC) IC31.1(A) IC31.9(CLR) IC31.14(VCC) IC33.20(VCC) IC37.1(A) IC37.9(CLR) IC37.14(VCC) IC38.1(A) IC38.9(CLR) IC38.14(VCC) IC39.16(VCC) IC40.16(VCC) ; also sheet 1,2,3,4
DGND: C1.2 C2.2 C3.2 C4.2 C5.2 C6.2 C47.2 C48.2 C50.2 IC10.7(P:GND) IC11.1(!OE) IC11.10(GND) IC18.1(!OE) IC18.10(GND) IC31.7(GND) IC33.1(!OE) IC33.10(GND) IC37.7(GND) IC38.7(GND) IC39.8(GND) IC39.10(SER) IC39.15(INH) IC40.8(GND) IC40.10(SER) IC40.15(INH) ; also sheet 1,2,3,4
DIR/CHAN: IC40.9(QH) ; also sheet 1
MCLK: IC31.8(CLK) IC37.8(CLK) IC38.8(CLK) IC39.2(CLK) IC40.2(CLK) ; also sheet 1,4
N$3: IC11.2(D0) IC37.3(QA)
N$4: IC11.3(D1) IC37.4(QB)
N$5: IC11.4(D2) IC37.5(QC)
N$6: IC11.5(D3) IC37.6(QD)
N$7: IC11.6(D4) IC37.10(QE)
N$8: IC11.7(D5) IC37.11(QF)
N$9: IC11.8(D6) IC37.12(QG)
N$10: IC11.9(D7) IC37.13(QH)
N$11: IC18.2(D0) IC31.3(QA)
N$12: IC18.3(D1) IC31.4(QB)
N$13: IC18.4(D2) IC31.5(QC)
N$14: IC18.5(D3) IC31.6(QD)
N$15: IC18.6(D4) IC31.10(QE)
N$16: IC18.7(D5) IC31.11(QF)
N$17: IC18.8(D6) IC31.12(QG)
N$18: IC18.9(D7) IC31.13(QH)
N$19: C7.1 IC19.8(VCC) R1.2
N$20: C8.1 IC20.8(VCC) R2.2
N$21: IC10.2(A:O) IC10.3(B:I) IC10.5(C:I)
N$22: IC10.8(D:O) IC10.11(E:I) IC10.13(F:I)
N$23: IC33.2(D0) IC38.3(QA)
N$24: IC33.3(D1) IC38.4(QB)
N$25: IC33.4(D2) IC38.5(QC)
N$26: IC33.5(D3) IC38.6(QD)
N$27: IC33.6(D4) IC38.10(QE)
N$28: IC33.7(D5) IC38.11(QF)
N$29: IC33.8(D6) IC38.12(QG)
N$30: IC33.9(D7) IC38.13(QH)
SCLK0: IC35.3(D1) ; also sheet 4
SCLK1: IC35.11(D2) ; also sheet 4
SCLK2: IC36.3(D1) ; also sheet 4
SCLK3: IC36.11(D2) ; also sheet 4
SLOTDIR0: IC40.11(A) ; also sheet 2,4
SLOTDIR1: IC40.12(B) ; also sheet 2,4
SLOTDIR2: IC40.13(C) ; also sheet 2,4
SLOTDIR3: IC40.14(D) ; also sheet 2,4
SRCLK: IC11.11(CLK) IC18.11(CLK) IC33.11(CLK) IC39.1(SH/!LD) IC40.1(SH/!LD) ; also sheet 1,4
Unconnected: IC11.12(O7) IC11.13(O6) IC11.14(O5) IC11.15(O4) IC18.12(O7) IC18.13(O6) IC18.14(O5) IC18.15(O4) IC19.1(NC) IC20.1(NC) IC33.12(O7) IC33.13(O6) IC33.14(O5) IC33.15(O4) IC35.7(NC) IC35.8(NC) IC35.14(NC) IC35.15(NC) IC35.16(NC) IC36.7(NC) IC36.8(NC) IC36.14(NC) IC36.15(NC) IC36.16(NC) IC39.7(!QH) IC40.7(!QH)

### Buses
!AMCS[0..3]
!DMCS[0..3]
SLOTDIR[0..3]
CHAN[0..3]
SCLK[0..3]

### Notes on the sheet
- Clock Oscillators
- 11.2896 MHz
- 24.5760 MHz
- ADC Chip Select
- OVF bits | Conversion direction, num. channels
- DAC Chip Select
- Clock Select

## Library data of the parts
C1-C50 = rcl:C-US: CAPACITOR, American symbol
IC1-IC9 IC15-IC17 IC23 IC25 = cdp:ADUM3402
IC10 IC12 = cdp:74*04: Hex INVERTER
IC11 IC18 IC33 = cdp:74LVTH574
IC13 = cdp:ADUM3400
IC19 IC20 = cdp:TENT-XO
IC22 IC24 = cdp:ADUM3401
IC26-IC29 = cdp:78XXL: VOLTAGE REGULATOR
IC30 = cdp:79XXL: VOLTAGE REGULATOR
IC31 IC37 IC38 = cdp:74*164: 8-bit parallel out SHIFT REGISTER
IC35 IC36 = cdp:ADG1436
IC39 IC40 = cdp:74*165: 8-bit parallel load SHIFT REGISTER
J1 = cdp:HIROSE-FX2-100S-1.27DS
J2-J4 J9 = cdp:SMD-30
J5 J6 J10-J13 = cdp:FASTON-0.250
R1 R2 = rcl:R-EU_: RESISTOR, European symbol